# Altium project EchoProject.PrjPcb
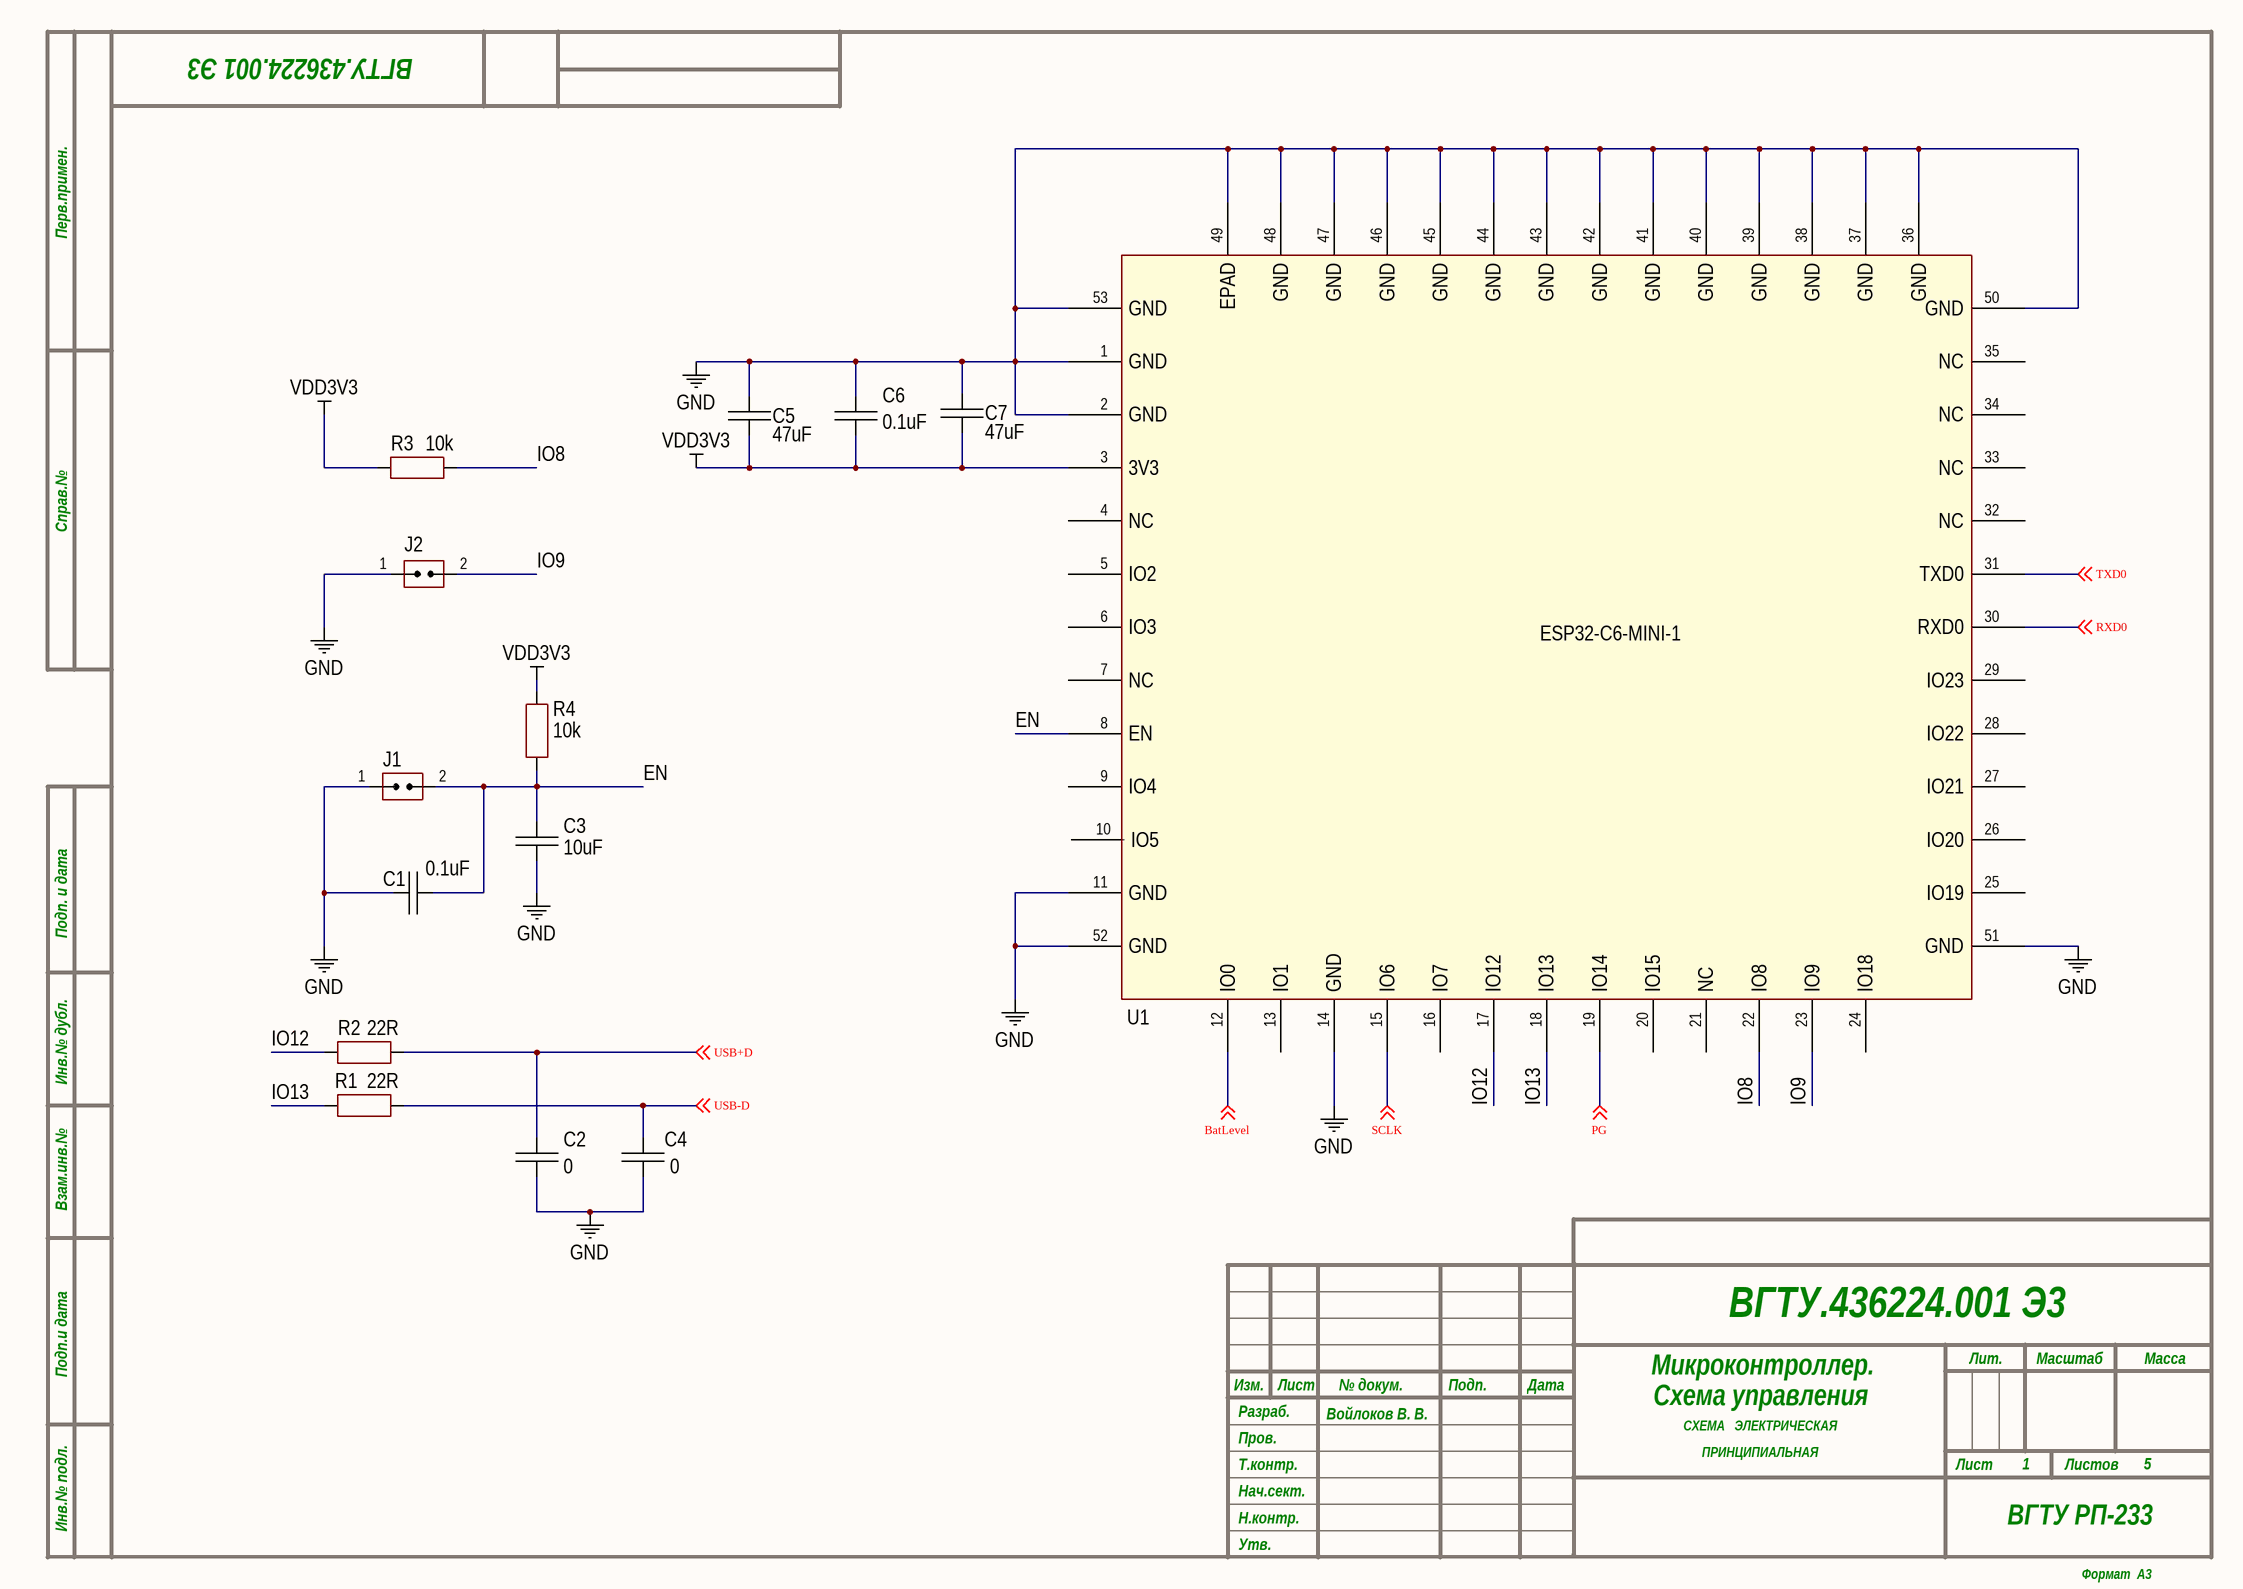
[diagram p0: 01_MCU_ESP32C6.SchDoc]
5 sheets, 71 parts. Net scope: global (net labels, ports and power ports of the same name join across sheets).
Sheets:
  01_MCU_ESP32C6.SchDoc
  02_ULTRASONIC_PGA460.SchDoc
  03_DCDC_BOOST.SchDoc
  04_DCDC_3V3.SchDoc
  05_BATTERY.SchDoc

## Sheet 01_MCU_ESP32C6.SchDoc
size 420 x 297 mm; Author: Войлоков В. В.; CompanyName: ВГТУ РП-233; Organization: ВГТУ; SheetNumber: 1; SheetTotal: 5; DecimalNumber: ВГТУ.436224.001; Name1: Микроконтроллер.; Name2: Схема управления

### Parts
C1  value 0.1uF  [CAP: 0603]
C2  value 0  [CAP: 0603]
C3  value 10uF  [CAP: 0603]
C4  value 0  [CAP: 0603]
C5  value 47uF  [CAP: 0805]
C6  value 0.1uF  [CAP: 0603]
C7  value 47uF  [CAP: 0805]
J1  (no value)  [CON: JUMPER x1]
J2  (no value)  [CON: JUMPER x1]
R1  value 22R  [RES: 0603]
R2  value 22R  [RES: 0603]
R3  value 10k  [RES: 0603]
R4  value 10k  [RES: 0603]
U1  ESP32-C6-MINI-1  [ESP32-C6_EXP]

### Nets
GND: C1.2 C2.2 C3.1 C4.2 C5.2 C6.2 C7.2 J1.1(IN) J2.1(IN) U1.1(GND) U1.2(GND) U1.11(GND) U1.14(GND) U1.36(GND) U1.37(GND) U1.38(GND) U1.39(GND) U1.40(GND) U1.41(GND) U1.42(GND) U1.43(GND) U1.44(GND) U1.45(GND) U1.46(GND) U1.47(GND) U1.48(GND) U1.49(EPAD) U1.50(GND) U1.51(GND) U1.52(GND) U1.53(GND)
VDD3V3: C5.1 C6.1 C7.1 R3.2 R4.2 U1.3(3V3)
BatLevel: U1.12(IO0) ; off-sheet BatLevel
EN: C1.1 C3.2 J1.2(IN) R4.1 U1.8(EN)
IO8: R3.1 U1.22(IO8)
IO9: J2.2(IN) U1.23(IO9)
IO12: R2.2 U1.17(IO12)
IO13: R1.2 U1.18(IO13)
PG: U1.19(IO14) ; off-sheet PG
RXD0: U1.30(RXD0) ; off-sheet RXD0
SCLK: U1.15(IO6) ; off-sheet SCLK
TXD0: U1.31(TXD0) ; off-sheet TXD0
USB+D: C2.1 R2.1 ; off-sheet USB+D
USB-D: C4.1 R1.1 ; off-sheet USB-D

Not connected (* = marked no-connect by the designer): U1 4(NC) 5(IO2) 6(IO3) 7(NC) 9(IO4) 10(IO5) 13(IO1) 16(IO7) 20(IO15) 21(NC) 24(IO18) 25(IO19) 26(IO20) 27(IO21) 28(IO22) 29(IO23) 32(NC) 33(NC) 34(NC) 35(NC)

### Notes on the sheet
- Перв.примен.
- Справ.№
- Подп. и дата
- Инв.№ дубл.
- Взам.инв.№
- Подп.и дата
- Разраб.
- Изм.
- Лист
- № докум.
- Подп.
- Дата
- Лит.
- Масштаб
- Масса
- Т.контр.
- Пров.
- СХЕМА   ЭЛЕКТРИЧЕСКАЯ
- ПРИНЦИПИАЛЬНАЯ
- Листов
- Инв.№ подл.
- Утв.
- Н.контр.
- Нач.сект.
- Формат  A3

### Library data of the parts
C1 C6 = Ceramic_0603: Manufacturer: Yageo; PartNumber: CC0603KRX7R7BB104; ValueManufacturerPartNumber: Ceramic capacitor, 0.1uF, X7R, ±10%, 16V, 0603, -55...+125°C; TypeCapacitor: Ceramic capacitor; Tolerance: ±10%; TypeDielectric: X7R; Voltage: 16V; Package: 0603; HelpURL: https://www.digikey.com/product-detail/en/yageo/CC0603KRX7R7BB104/311-1088-1-ND/302998; Temperature: -55...+125°C
C2 C4 = Ceramic_0603: Manufacturer: Yageo; PartNumber: CC0603KRX7R7BB104; ValueManufacturerPartNumber: Ceramic capacitor, 0, X7R, ±10%, 16V, 0603, -55...+125°C; TypeCapacitor: Ceramic capacitor; Tolerance: ±10%; TypeDielectric: X7R; Voltage: 16V; Package: 0603; HelpURL: https://www.digikey.com/product-detail/en/yageo/CC0603KRX7R7BB104/311-1088-1-ND/302998; Temperature: -55...+125°C
C3 = Ceramic_0603: Manufacturer: Yageo; PartNumber: CC0603KRX7R7BB104; ValueManufacturerPartNumber: Ceramic capacitor, 10uF, X7R, ±10%, 16V, 0603, -55...+125°C; TypeCapacitor: Ceramic capacitor; Tolerance: ±10%; TypeDielectric: X7R; Voltage: 16V; Package: 0603; HelpURL: https://www.digikey.com/product-detail/en/yageo/CC0603KRX7R7BB104/311-1088-1-ND/302998; Temperature: -55...+125°C
C5 C7 = Ceramic_0805: Manufacturer: Yageo; PartNumber: CC0805KRX7R7BB104; ValueManufacturerPartNumber: Ceramic capacitor, 47uF, X7R, ±10%, 16V, 0805, -55...+125°C; TypeCapacitor: Ceramic capacitor; Tolerance: ±10%; TypeDielectric: X7R; Voltage: 16V; Package: 0805; HelpURL: https://www.digikey.com/product-detail/en/yageo/CC0805KRX7R7BB104/311-1142-1-ND/303052; Temperature: -55...+125°C
J1 J2 = Jumper_single: CommentText: "Перемычка"
R1 R2 = Resistor_0603: Manufacturer: Yageo; PartNumber: RC0603JR-07100RL; ValueManufacturerPartNumber: Resistor film, 22R, ±5%, 0603, 0.1W, -55...+125°C; TypeResistor: Resistor film; Power: 0.1W; Tolerance: ±5%; Package: 0603; HelpURL: https://www.digikey.com/product-detail/en/yageo/RC0603JR-07100RL/311-100GRCT-ND/729644; Temperature: -55...+125°C
R3 R4 = Resistor_0603: Manufacturer: Yageo; PartNumber: RC0603JR-07100RL; ValueManufacturerPartNumber: Resistor film, 10k, ±5%, 0603, 0.1W, -55...+125°C; TypeResistor: Resistor film; Power: 0.1W; Tolerance: ±5%; Package: 0603; HelpURL: https://www.digikey.com/product-detail/en/yageo/RC0603JR-07100RL/311-100GRCT-ND/729644; Temperature: -55...+125°C

## Sheet 02_ULTRASONIC_PGA460.SchDoc
size 420 x 297 mm; Author: Войлоков В. В.; CompanyName: ВГТУ РП-233; SheetNumber: 2; SheetTotal: 5; DecimalNumber: ВГТУ.436224.001; Name1: Приемопередатчик; Name2: ультразвуковой
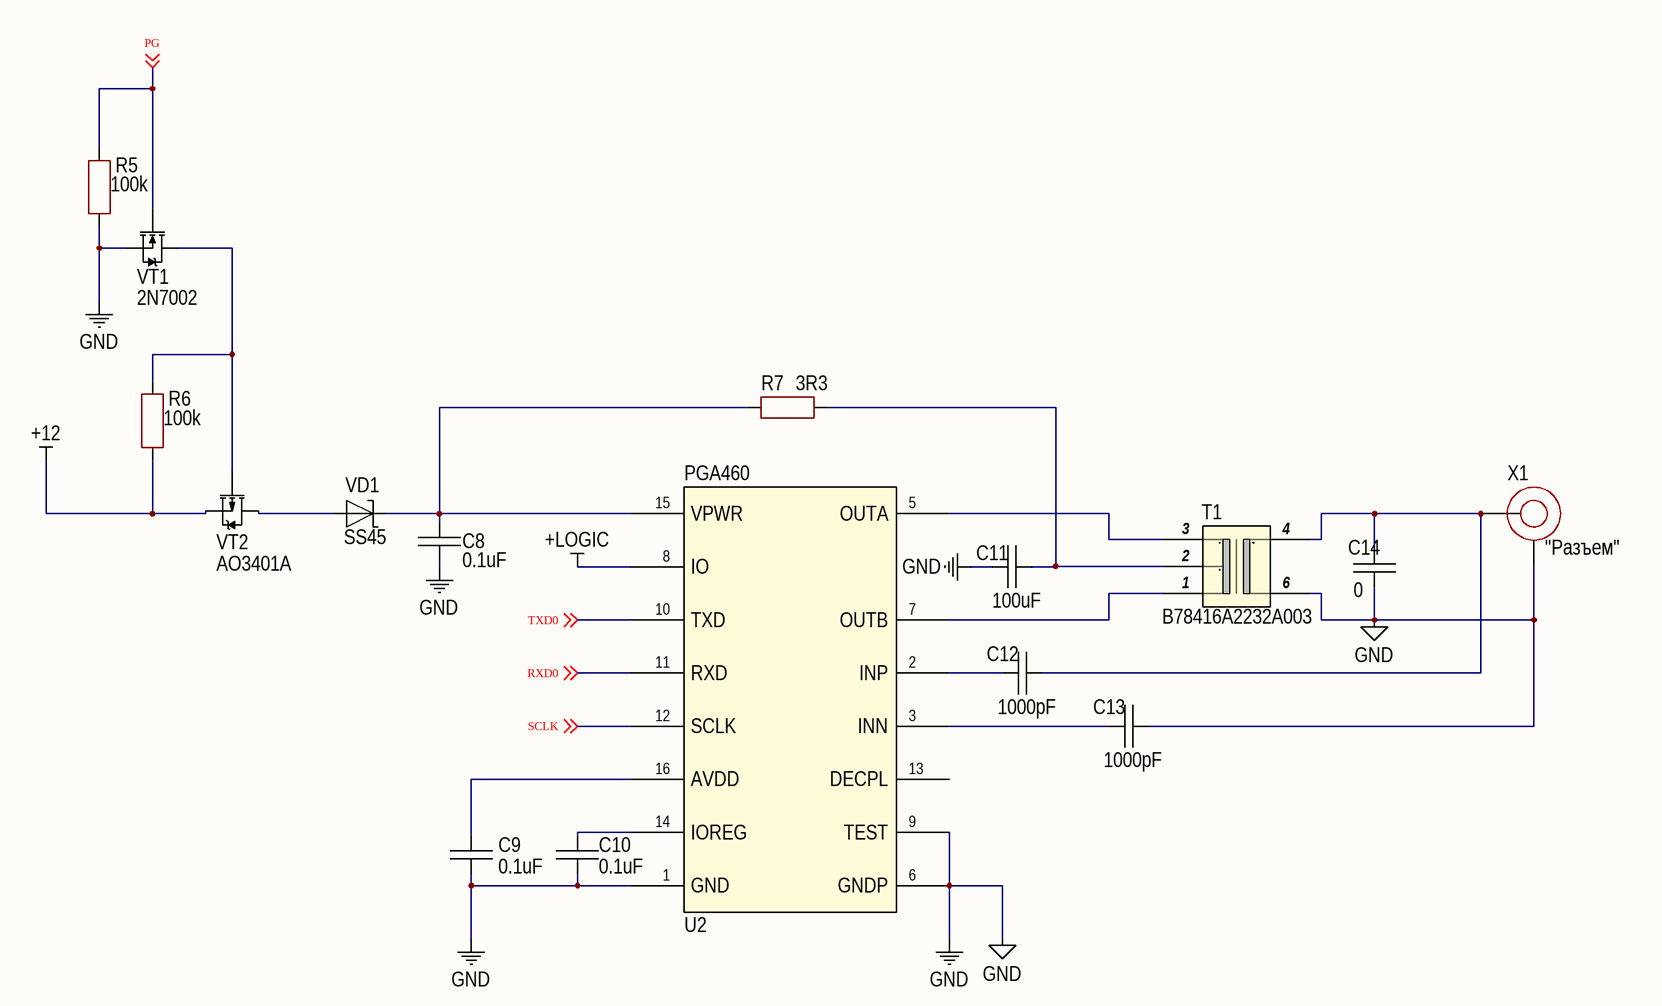
[diagram p1: 02_ULTRASONIC_PGA460.SchDoc]

### Parts
C8  value 0.1uF  [CAP: 0603]
C9  value 0.1uF  [CAP: 0603]
C10  value 0.1uF  [CAP: 0603]
C11  value 100uF  [CAP: 1206]
C12  value 1000pF  [CAP: 0805]
C13  value 1000pF  [CAP: 0805]
C14  value 0  [CAP: 0805]
R5  value 100k  [RES: 0603]
R6  value 100k  [RES: 0603]
R7  value 3R3  [RES: 2010]
T1  B78416A2232A003  [B78416_TDK]
U2  PGA460  [16-TSSOP]
VD1  PartNumber: SS45  [DIODE: SMC]
VT1  PartNumber: 2N7002  [SOT23]
VT2  PartNumber: AO3401A  [SOT23]
X1  CommentText: "Разъем"  [CON: SMA]

### Nets
+12: R6.1 VT2.2(S)
+LOGIC: U2.8(IO)
GND: C8.1 C9.1 C10.1 C11.2 C13.1 C14.2 R5.1 T1.6 U2.1(GND) U2.6(GNDP) U2.9(TEST) VT1.2(S) X1.2
PG: R5.2 VT1.1(G) ; off-sheet PG
RXD0: U2.11(RXD) ; off-sheet RXD0
SCLK: U2.12(SCLK) ; off-sheet SCLK
TXD0: U2.10(TXD) ; off-sheet TXD0
NetC8_2: C8.2 R7.1 U2.15(VPWR) VD1.2
NetC9_2: C9.2 U2.16(AVDD)
NetC10_2: C10.2 U2.14(IOREG)
NetC11_1: C11.1 R7.2 T1.2
NetC12_1: C12.1 C14.1 T1.4 X1.1
NetC12_2: C12.2 U2.2(INP)
NetC13_2: C13.2 U2.3(INN)
NetR6_2: R6.2 VT1.3(D) VT2.1(G)
NetT1_1: T1.1 U2.7(OUTB)
NetT1_3: T1.3 U2.5(OUTA)
NetVD1_1: VD1.1 VT2.3(D)

Not connected (* = marked no-connect by the designer): U2 13(DECPL)

### Notes on the sheet
- Перв.примен.
- Справ.№
- Подп. и дата
- Инв.№ дубл.
- Взам.инв.№
- Подп.и дата
- Разраб.
- Изм.
- Лист
- № докум.
- Подп.
- Дата
- Лит.
- Масштаб
- Масса
- Т.контр.
- Пров.
- СХЕМА   ЭЛЕКТРИЧЕСКАЯ
- ПРИНЦИПИАЛЬНАЯ
- Листов
- Инв.№ подл.
- Утв.
- Н.контр.
- Нач.сект.
- Формат  A3

### Library data of the parts
C8-C10 = Ceramic_0603: as C1 on sheet 01_MCU_ESP32C6; Package: 0603; HelpURL: https://www.digikey.com/product-detail/en/yageo/CC0603KRX7R7BB104/311-1088-1-ND/302998; Temperature: -55...+125°C
C11 = Ceramic_1206: Manufacturer: Yageo; PartNumber: CC1206KRX7R9BB104; ValueManufacturerPartNumber: Ceramic capacitor, 100uF, X7R, ±10%, 50V, 1206, -55...+125°C; TypeCapacitor: Ceramic capacitor; Tolerance: ±10%; TypeDielectric: X7R; Voltage: 50V; Package: 1206; HelpURL: https://www.digikey.com/product-detail/en/yageo/CC1206KRX7R9BB104/311-1179-1-ND/303089; Temperature: -55...+125°C
C12 C13 = Ceramic_0805: Manufacturer: Yageo; PartNumber: CC0805KRX7R7BB104; ValueManufacturerPartNumber: Ceramic capacitor, 1000pF, NP0, ±5%, 500V, 0805, -55...+125°C; TypeCapacitor: Ceramic capacitor; Tolerance: ±5%; TypeDielectric: NP0; Voltage: 500V; Package: 0805; HelpURL: https://www.digikey.com/product-detail/en/yageo/CC0805KRX7R7BB104/311-1142-1-ND/303052; Temperature: -55...+125°C
C14 = Ceramic_0805: Manufacturer: Yageo; PartNumber: CC0805KRX7R7BB104; ValueManufacturerPartNumber: Ceramic capacitor, 0, NP0, ±5%, 16V, 0805, -55...+125°C; TypeCapacitor: Ceramic capacitor; Tolerance: ±5%; TypeDielectric: NP0; Voltage: 16V; Package: 0805; HelpURL: https://www.digikey.com/product-detail/en/yageo/CC0805KRX7R7BB104/311-1142-1-ND/303052; Temperature: -55...+125°C
R5 R6 = Resistor_0603: Manufacturer: Yageo; PartNumber: RC0603JR-07100RL; ValueManufacturerPartNumber: Resistor film, 100k, ±5%, 0603, 0.1W, -55...+125°C; TypeResistor: Resistor film; Power: 0.1W; Tolerance: ±5%; Package: 0603; HelpURL: https://www.digikey.com/product-detail/en/yageo/RC0603JR-07100RL/311-100GRCT-ND/729644; Temperature: -55...+125°C
R7 = Resistor_2010: Manufacturer: Yageo; PartNumber: RC2010JK-07100RL; ValueManufacturerPartNumber: Resistor film, 3R3, ±5%, 2010, 0.75W, -55...+125°C; TypeResistor: Resistor film; Power: 0.75W; Tolerance: ±5%; Package: 2010; HelpURL: https://www.digikey.com/product-detail/en/yageo/RC2010JK-07100RL/YAG3381CT-ND/5962203; Temperature: -55...+125°C
T1 = B78416A2232A003: Description; Manufacturer_Name: TDK; Copyright: Copyright (C) 2025 Ultra Librarian. All rights reserved.; Manufacturer_Part_Number: B78416A2232A003; RefDes: RefDes; Type: Type
U2 = PGA460: pin to pad: 1>1+4
VD1 = Schottky_single: Manufacturer: Diodes Incorporated; ValueManufacturerPartNumber: Schottky diode, 80V, 500mA, 1V, 15pF, SOD-123, -55...+150°C; TypeDiode: Schottky diode; Voltage: 80V; Current: 500mA; VoltageDrop: 1V; RecoveryTime: 15pF; Package: SOD-123; HelpURL: https://www.digikey.com/product-detail/en/diodes-incorporated/MBR0580S1-7/MBR0580S1-7DICT-ND/5080371; Temperature: -55...+150°C
VT1 = MOSFET_N_132: Manufacturer: Infineon Technologies; ValueManufacturerPartNumber: MOSFET N-channel transistor, 80V, 7A, 9.1nC, 2.5W, 34mOhm, 756pF, 8-TDSON, -55...+150°C; TypeTransistor: MOSFET N-channel transistor; VoltageDS: 80V; CurrentDS: 7A; RDS: 34mOhm; GateCharge: 9.1nC; InputCapacitor: 756pF; MaxPower: 2.5W; Package: 8-TDSON; HelpURL: https://www.digikey.com/product-detail/en/infineon-technologies/BSC340N08NS3GATMA1/BSC340N08NS3GATMA1TR-ND/2080655; Temperature: -55...+150°C
VT2 = MOSFET_P_132: Manufacturer: Infineon Technologies; ValueManufacturerPartNumber: MOSFET P-channel transistor, 20V, 2.6A, 2.9nC, 2.5W, 135mOhm, 220pF, SOT-23, -55...+150°C; TypeTransistor: MOSFET P-channel transistor; VoltageDS: 20V; CurrentDS: 2.6A; RDS: 135mOhm; GateCharge: 2.9nC; InputCapacitor: 220pF; MaxPower: 2.5W; Package: SOT-23; HelpURL: https://www.digikey.com/product-detail/en/infineon-technologies/IRLML2246TRPBF/IRLML2246TRPBFCT-ND/2639576; Temperature: -55...+150°C
X1 = Connector_SMA: Manufacturer: TE Connectivity; ValueManufacturerPartNumber: Connector SMA, 50 Ohm, 3GHz; PartNumber: 5-1814832-1; TypeConnector: Connector SMA; Frequency: 3GHz; Impedance: 50 Ohm; HelpURL: https://www.digikey.com/product-detail/en/te-connectivity-amp-connectors/5-1814832-1/A97594-ND/1755982

## Sheet 03_DCDC_BOOST.SchDoc
size 209 x 297 mm; Author: Войлоков В. М.; CompanyName: ВГТУ РП-233; SheetNumber: 3; SheetTotal: 5; DecimalNumber: ВГТУ.436224.001; Name1: Преобразователь; Name2: напряжения к 12В
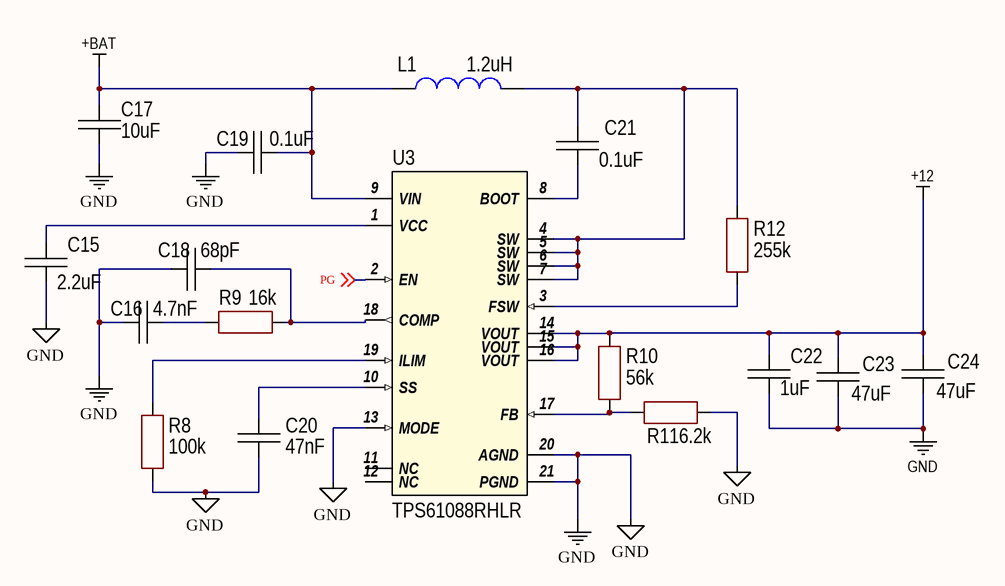
[diagram p2: 03_DCDC_BOOST.SchDoc]

### Parts
C15  value 2.2uF  [CAP: 0805]
C16  value 4.7nF  [CAP: 0805]
C17  value 10uF  [CAP: 1206]
C18  value 68pF  [CAP: 0805]
C19  value 0.1uF  [CAP: 0603]
C20  value 47nF  [CAP: 0603]
C21  value 0.1uF  [CAP: 1210]
C22  value 1uF  [CAP: 0805]
C23  value 47uF  [CAP: 1206]
C24  value 47uF  [CAP: 1206]
L1  value 1.2uH  [IND: SRP1265A]
R8  value 100k  [RES: 0603]
R9  value 16k  [RES: 0603]
R10  value 56k  [RES: 0603]
R11  value 6.2k  [RES: 0603]
R12  value 255k  [RES: 0603]
U3  TPS61088RHLR  [RHL0020A]

### Nets
+12: C22.2 C23.2 C24.2 R10.2 U3.14(VOUT) U3.15(VOUT) U3.16(VOUT)
+BAT: C17.1 C19.1 L1.2 U3.9(VIN)
GND: C15.1 C16.2 C17.2 C18.2 C19.2 C20.1 C22.1 C23.1 C24.1 R8.1 R11.2 U3.13(MODE) U3.20(AGND) U3.21(PGND)
PG: U3.2(EN) ; off-sheet PG
NetC15_2: C15.2 U3.1(VCC)
NetC16_1: C16.1 R9.1
NetC18_1: C18.1 R9.2 U3.18(COMP)
NetC20_2: C20.2 U3.10(SS)
NetC21_1: C21.1 U3.8(BOOT)
NetC21_2: C21.2 L1.1 R12.2 U3.4(SW) U3.5(SW) U3.6(SW) U3.7(SW)
NetR8_2: R8.2 U3.19(ILIM)
NetR10_1: R10.1 R11.1 U3.17(FB)
NetR12_1: R12.1 U3.3(FSW)

Not connected (* = marked no-connect by the designer): U3 11(NC) 12(NC)

### Notes on the sheet
- Перв.примен.
- Справ.№
- Подп. и дата
- Инв.№ дубл.
- Взам.инв.№
- Подп.и дата
- Разраб.
- Изм.
- Лист
- № докум.
- Подп.
- Дата
- Лит.
- Масштаб
- Масса
- Т.контр.
- Пров.
- СХЕМА   ЭЛЕКТРИЧЕСКАЯ
- ПРИНЦИПИАЛЬНАЯ
- Листов
- Инв.№ подл.
- Утв.
- Н.контр.
- Нач.сект.

### Library data of the parts
C15 = Ceramic_0805: Manufacturer: Yageo; PartNumber: CC0805KRX7R7BB104; ValueManufacturerPartNumber: Ceramic capacitor, 2.2uF, X7R, ±10%, 16V, 0805, -55...+125°C; TypeCapacitor: Ceramic capacitor; Tolerance: ±10%; TypeDielectric: X7R; Voltage: 16V; Package: 0805; HelpURL: https://www.digikey.com/product-detail/en/yageo/CC0805KRX7R7BB104/311-1142-1-ND/303052; Temperature: -55...+125°C
C16 = Ceramic_0805: Manufacturer: Yageo; PartNumber: CC0805KRX7R7BB104; ValueManufacturerPartNumber: Ceramic capacitor, 4.7nF, X7R, ±10%, 16V, 0805, -55...+125°C; TypeCapacitor: Ceramic capacitor; Tolerance: ±10%; TypeDielectric: X7R; Voltage: 16V; Package: 0805; HelpURL: https://www.digikey.com/product-detail/en/yageo/CC0805KRX7R7BB104/311-1142-1-ND/303052; Temperature: -55...+125°C
C17 = Ceramic_1206: Manufacturer: Yageo; PartNumber: CC1206KRX7R9BB104; ValueManufacturerPartNumber: Ceramic capacitor, 10uF, X7R, ±10%, 50V, 1206, -55...+125°C; TypeCapacitor: Ceramic capacitor; Tolerance: ±10%; TypeDielectric: X7R; Voltage: 50V; Package: 1206; HelpURL: https://www.digikey.com/product-detail/en/yageo/CC1206KRX7R9BB104/311-1179-1-ND/303089; Temperature: -55...+125°C
C18 = Ceramic_0805: Manufacturer: Yageo; PartNumber: CC0805KRX7R7BB104; ValueManufacturerPartNumber: Ceramic capacitor, 68pF, X7R, ±10%, 16V, 0805, -55...+125°C; TypeCapacitor: Ceramic capacitor; Tolerance: ±10%; TypeDielectric: X7R; Voltage: 16V; Package: 0805; HelpURL: https://www.digikey.com/product-detail/en/yageo/CC0805KRX7R7BB104/311-1142-1-ND/303052; Temperature: -55...+125°C
C19 = Ceramic_0603: as C1 on sheet 01_MCU_ESP32C6; Package: 0603; HelpURL: https://www.digikey.com/product-detail/en/yageo/CC0603KRX7R7BB104/311-1088-1-ND/302998; Temperature: -55...+125°C
C20 = Ceramic_0603: Manufacturer: Yageo; PartNumber: CC0603KRX7R7BB104; ValueManufacturerPartNumber: Ceramic capacitor, 47nF, X7R, ±10%, 16V, 0603, -55...+125°C; TypeCapacitor: Ceramic capacitor; Tolerance: ±10%; TypeDielectric: X7R; Voltage: 16V; Package: 0603; HelpURL: https://www.digikey.com/product-detail/en/yageo/CC0603KRX7R7BB104/311-1088-1-ND/302998; Temperature: -55...+125°C
C21 = Ceramic_1210: Manufacturer: Yageo; PartNumber: CC1210KKX7R9BB104; ValueManufacturerPartNumber: Ceramic capacitor, 0.1uF, X7R, ±10%, 50V, 1210, -55...+125°C; TypeCapacitor: Ceramic capacitor; Tolerance: ±10%; TypeDielectric: X7R; Voltage: 50V; Package: 1210; HelpURL: https://www.digikey.com/product-detail/en/yageo/CC1210KKX7R9BB104/311-4522-1-ND/8025611; Temperature: -55...+125°C
C22 = Ceramic_0805: Manufacturer: Yageo; PartNumber: CC0805KRX7R7BB104; ValueManufacturerPartNumber: Ceramic capacitor, 1uF, X7R, ±10%, 16V, 0805, -55...+125°C; TypeCapacitor: Ceramic capacitor; Tolerance: ±10%; TypeDielectric: X7R; Voltage: 16V; Package: 0805; HelpURL: https://www.digikey.com/product-detail/en/yageo/CC0805KRX7R7BB104/311-1142-1-ND/303052; Temperature: -55...+125°C
C23 C24 = Ceramic_1206: Manufacturer: Yageo; PartNumber: CC1206KRX7R9BB104; ValueManufacturerPartNumber: Ceramic capacitor, 47uF, X7R, ±10%, 50V, 1206, -55...+125°C; TypeCapacitor: Ceramic capacitor; Tolerance: ±10%; TypeDielectric: X7R; Voltage: 50V; Package: 1206; HelpURL: https://www.digikey.com/product-detail/en/yageo/CC1206KRX7R9BB104/311-1179-1-ND/303089; Temperature: -55...+125°C
L1 = Inductor_SRP1265A: Manufacturer: Bourns; PartNumber: SRP1265A-4R7M; ValueManufacturerPartNumber: Fixed inductor, 1.2uH, ±20%, SRP1265A, 13.5A, -40...+150°C; TypeInductor: Fixed inductor; MaxCurrent: 13.5A; Tolerance: ±20%; Package: SRP1265A; HelpURL: https://www.digikey.com/product-detail/en/bourns-inc/SRP1265A-4R7M/SRP1265A-4R7MCT-ND/4876721; Temperature: -40...+150°C
R8 = Resistor_0603: as R5 on sheet 02_ULTRASONIC_PGA460; Package: 0603; HelpURL: https://www.digikey.com/product-detail/en/yageo/RC0603JR-07100RL/311-100GRCT-ND/729644; Temperature: -55...+125°C
R9 = Resistor_0603: Manufacturer: Yageo; PartNumber: RC0603JR-07100RL; ValueManufacturerPartNumber: Resistor film, 16k, ±5%, 0603, 0.1W, -55...+125°C; TypeResistor: Resistor film; Power: 0.1W; Tolerance: ±5%; Package: 0603; HelpURL: https://www.digikey.com/product-detail/en/yageo/RC0603JR-07100RL/311-100GRCT-ND/729644; Temperature: -55...+125°C
R10 = Resistor_0603: Manufacturer: Yageo; PartNumber: RC0603JR-07100RL; ValueManufacturerPartNumber: Resistor film, 56k, ±5%, 0603, 0.1W, -55...+125°C; TypeResistor: Resistor film; Power: 0.1W; Tolerance: ±5%; Package: 0603; HelpURL: https://www.digikey.com/product-detail/en/yageo/RC0603JR-07100RL/311-100GRCT-ND/729644; Temperature: -55...+125°C
R11 = Resistor_0603: Manufacturer: Yageo; PartNumber: RC0603JR-07100RL; ValueManufacturerPartNumber: Resistor film, 6.2k, ±5%, 0603, 0.1W, -55...+125°C; TypeResistor: Resistor film; Power: 0.1W; Tolerance: ±5%; Package: 0603; HelpURL: https://www.digikey.com/product-detail/en/yageo/RC0603JR-07100RL/311-100GRCT-ND/729644; Temperature: -55...+125°C
R12 = Resistor_0603: Manufacturer: Yageo; PartNumber: RC0603JR-07100RL; ValueManufacturerPartNumber: Resistor film, 255k, ±5%, 0603, 0.1W, -55...+125°C; TypeResistor: Resistor film; Power: 0.1W; Tolerance: ±5%; Package: 0603; HelpURL: https://www.digikey.com/product-detail/en/yageo/RC0603JR-07100RL/311-100GRCT-ND/729644; Temperature: -55...+125°C
U3 = TPS61088RHLR: 10-A Fully-Integrated Synchronous Boost Converter 20-VQFN -40 to 125; Manufacturer_Name: Texas Instruments; Alternate_PartNumber: TPS61088RHLT; CompType: IC; TYPE: TYPE; RefDes: RefDes; Copyright: Copyright (C) 2026 Ultra Librarian. All rights reserved.; Manufacturer_Part_Number: TPS61088RHLR; Application_BuildNumber: *; PartNumber: TPS61088RHLR; PackageReference: RHL0020A; MountType: SMT; RoHS: Y; Manufacturer: Texas Instruments

## Sheet 04_DCDC_3V3.SchDoc
size 209 x 297 mm; Author: Войлоков В. М.; CompanyName: ВГТУ РП-233; SheetNumber: 4; SheetTotal: 5; DecimalNumber: 123; Name1: Преобразователь; Name2: напряжения к 3.3В
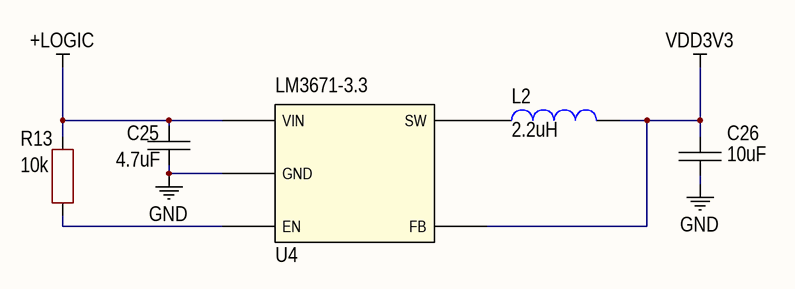
[diagram p3: 04_DCDC_3V3.SchDoc]

### Parts
C25  value 4.7uF  [CAP: 0805]
C26  value 10uF  [CAP: 0805]
L2  value 2.2uH  [IND: SDR0805]
R13  value 10k  [RES: 0603]
U4  LM3671-3.3  [SOT23-5]

### Nets
+LOGIC: C25.2 R13.2 U4.1(VIN)
GND: C25.1 C26.1 U4.2(GND)
VDD3V3: C26.2 L2.1 U4.4(FB)
NetL2_2: L2.2 U4.5(SW)
NetR13_1: R13.1 U4.3(EN)

### Notes on the sheet
- Перв.примен.
- Справ.№
- Подп. и дата
- Инв.№ дубл.
- Взам.инв.№
- Подп.и дата
- Разраб.
- Изм.
- Лист
- № докум.
- Подп.
- Дата
- Лит.
- Масштаб
- Масса
- Т.контр.
- Пров.
- СХЕМА   ЭЛЕКТРИЧЕСКАЯ
- ПРИНЦИПИАЛЬНАЯ
- Листов
- Инв.№ подл.
- Утв.
- Н.контр.
- Нач.сект.

### Library data of the parts
C25 = Ceramic_0805: Manufacturer: Yageo; PartNumber: CC0805KRX7R7BB104; ValueManufacturerPartNumber: Ceramic capacitor, 4.7uF, X7R, ±10%, 16V, 0805, -55...+125°C; TypeCapacitor: Ceramic capacitor; Tolerance: ±10%; TypeDielectric: X7R; Voltage: 16V; Package: 0805; HelpURL: https://www.digikey.com/product-detail/en/yageo/CC0805KRX7R7BB104/311-1142-1-ND/303052; Temperature: -55...+125°C
C26 = Ceramic_0805: Manufacturer: Yageo; PartNumber: CC0805KRX7R7BB104; ValueManufacturerPartNumber: Ceramic capacitor, 10uF, X7R, ±10%, 16V, 0805, -55...+125°C; TypeCapacitor: Ceramic capacitor; Tolerance: ±10%; TypeDielectric: X7R; Voltage: 16V; Package: 0805; HelpURL: https://www.digikey.com/product-detail/en/yageo/CC0805KRX7R7BB104/311-1142-1-ND/303052; Temperature: -55...+125°C
L2 = Inductor_SDR0805: Manufacturer: Bourns; PartNumber: SDR0805-4R7ML; ValueManufacturerPartNumber: Fixed inductor, 2.2uH, ±20%, SDR0805, 3.7A, -40...+125°C; TypeInductor: Fixed inductor; MaxCurrent: 3.7A; Tolerance: ±20%; Package: SDR0805; HelpURL: https://www.digikey.com/product-detail/en/bourns-inc/SDR0805-4R7ML/SDR0805-4R7MLCT-ND/2352947; Temperature: -40...+125°C
R13 = Resistor_0603: as R3 on sheet 01_MCU_ESP32C6; Package: 0603; HelpURL: https://www.digikey.com/product-detail/en/yageo/RC0603JR-07100RL/311-100GRCT-ND/729644; Temperature: -55...+125°C
U4 = LM3671-3.3: Manufacturer: Texas Instruments; Vin: 2.7V - 5.5V; Vout: 3.3V; Iout: 600 mA

## Sheet 05_BATTERY.SchDoc
size 420 x 297 mm; Author: Войлоков В. М.; CompanyName: ВГТУ РП-233; SheetNumber: 5; SheetTotal: 5; DecimalNumber: ВГТУ.436224.001; Name1: Контроллер; Name2: заряда
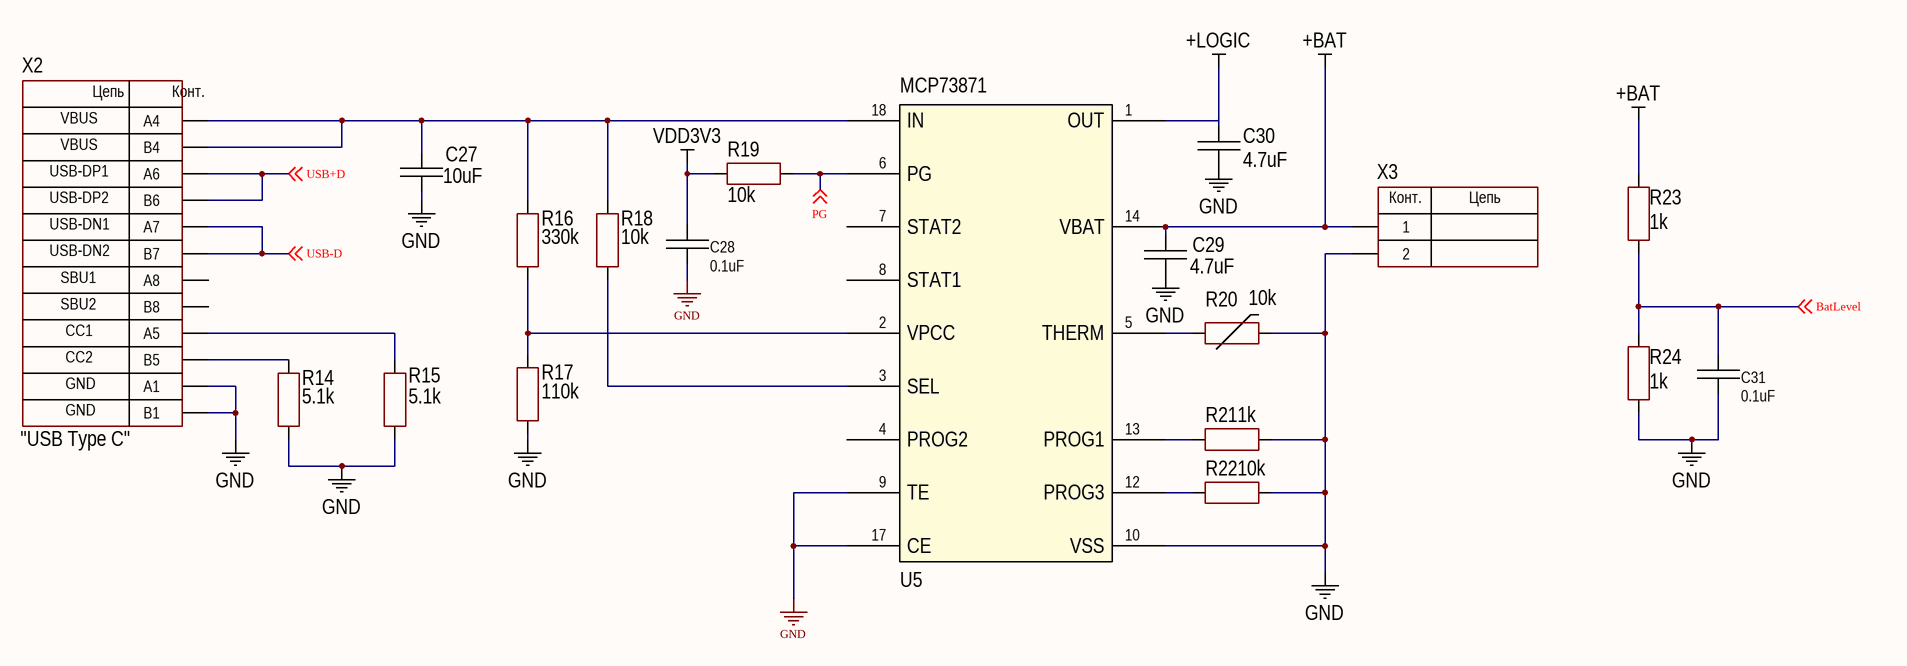
[diagram p4: 05_BATTERY.SchDoc]

### Parts
C27  value 10uF  [CAP: 0805]
C28  value 0.1uF  [CAP: 0603]
C29  value 4.7uF  [CAP: 0805]
C30  value 4.7uF  [CAP: 0805]
C31  value 0.1uF  [CAP: 0603]
R14  value 5.1k  [RES: 0603]
R15  value 5.1k  [RES: 0603]
R16  value 330k  [RES: 0603]
R17  value 110k  [RES: 0603]
R18  value 10k  [RES: 0603]
R19  value 10k  [RES: 0603]
R20  value 10k  [RES: B57237 (NTC)]
R21  value 1k  [RES: 0603]
R22  value 10k  [RES: 0603]
R23  value 1k  [RES: 0603]
R24  value 1k  [RES: 0603]
U5  MCP73871  [20-QFN (4x4)]
X2  CommentText: "USB Type C"  [CON: TYPE-C-31-M-12]
X3  (no value)  [CON: CWF-2R]

### Nets
+BAT: C29.2 R23.1 U5.14(VBAT) X3.1
+LOGIC: C30.2 U5.1(OUT)
GND: C27.1 C28.1 C29.1 C30.1 C31.1 R14.2 R15.2 R17.1 R20.2 R21.2 R22.2 R24.2 U5.9(TE) U5.10(VSS) U5.17(CE) X2.A1 X2.B1 X3.2
VDD3V3: C28.2 R19.2
BatLevel: C31.2 R23.2 R24.1 ; off-sheet BatLevel
PG: R19.1 U5.6(PG) ; off-sheet PG
USB+D: X2.A6 X2.B6 ; off-sheet USB+D
USB-D: X2.A7 X2.B7 ; off-sheet USB-D
NetC27_2: C27.2 R16.2 R18.2 U5.18(IN) X2.A4 X2.B4
NetR14_1: R14.1 X2.B5
NetR15_1: R15.1 X2.A5
NetR16_1: R16.1 R17.2 U5.2(VPCC)
NetR18_1: R18.1 U5.3(SEL)
NetR20_1: R20.1 U5.5(THERM)
NetR21_1: R21.1 U5.13(PROG1)
NetR22_1: R22.1 U5.12(PROG3)

Not connected (* = marked no-connect by the designer): U5 4(PROG2) 7(STAT2) 8(STAT1); X2 A8 B8

### Notes on the sheet
- Перв.примен.
- Справ.№
- Подп. и дата
- Инв.№ дубл.
- Взам.инв.№
- Подп.и дата
- Разраб.
- Изм.
- Лист
- № докум.
- Подп.
- Дата
- Лит.
- Масштаб
- Масса
- Т.контр.
- Пров.
- СХЕМА   ЭЛЕКТРИЧЕСКАЯ
- ПРИНЦИПИАЛЬНАЯ
- Листов
- Инв.№ подл.
- Утв.
- Н.контр.
- Нач.сект.
- Формат  A3
- (in symbol Connector_USB_Type_C) Цепь; Конт.; VBUS; USB-DP1; USB-DP2; USB-DN1; USB-DN2; SBU1; SBU2; CC1; CC2; GND
- (in symbol CWF-2) Конт.; Цепь

### Library data of the parts
C27 = Ceramic_0805: as C26 on sheet 04_DCDC_3V3; Package: 0805; HelpURL: https://www.digikey.com/product-detail/en/yageo/CC0805KRX7R7BB104/311-1142-1-ND/303052; Temperature: -55...+125°C
C28 C31 = Ceramic_0603: as C1 on sheet 01_MCU_ESP32C6; Package: 0603; HelpURL: https://www.digikey.com/product-detail/en/yageo/CC0603KRX7R7BB104/311-1088-1-ND/302998; Temperature: -55...+125°C
C29 C30 = Ceramic_0805: as C25 on sheet 04_DCDC_3V3; Package: 0805; HelpURL: https://www.digikey.com/product-detail/en/yageo/CC0805KRX7R7BB104/311-1142-1-ND/303052; Temperature: -55...+125°C
R14 R15 = Resistor_0603: Manufacturer: Yageo; PartNumber: RC0603JR-07100RL; ValueManufacturerPartNumber: Resistor film, 5.1k, ±1%, 0603, 0.1W, -55...+125°C; TypeResistor: Resistor film; Power: 0.1W; Tolerance: ±1%; Package: 0603; HelpURL: https://www.digikey.com/product-detail/en/yageo/RC0603JR-07100RL/311-100GRCT-ND/729644; Temperature: -55...+125°C
R16 = Resistor_0603: Manufacturer: Yageo; PartNumber: RC0603JR-07100RL; ValueManufacturerPartNumber: Resistor film, 330k, ±1%, 0603, 0.1W, -55...+125°C; TypeResistor: Resistor film; Power: 0.1W; Tolerance: ±1%; Package: 0603; HelpURL: https://www.digikey.com/product-detail/en/yageo/RC0603JR-07100RL/311-100GRCT-ND/729644; Temperature: -55...+125°C
R17 = Resistor_0603: Manufacturer: Yageo; PartNumber: RC0603JR-07100RL; ValueManufacturerPartNumber: Resistor film, 110k, ±1%, 0603, 0.1W, -55...+125°C; TypeResistor: Resistor film; Power: 0.1W; Tolerance: ±1%; Package: 0603; HelpURL: https://www.digikey.com/product-detail/en/yageo/RC0603JR-07100RL/311-100GRCT-ND/729644; Temperature: -55...+125°C
R18 R19 R22 = Resistor_0603: Manufacturer: Yageo; PartNumber: RC0603JR-07100RL; ValueManufacturerPartNumber: Resistor film, 10k, ±1%, 0603, 0.1W, -55...+125°C; TypeResistor: Resistor film; Power: 0.1W; Tolerance: ±1%; Package: 0603; HelpURL: https://www.digikey.com/product-detail/en/yageo/RC0603JR-07100RL/311-100GRCT-ND/729644; Temperature: -55...+125°C
R20 = NTC: Manufacturer: Epcos; PartNumber: B57237S229M54; ValueManufacturerPartNumber: NTC resistor, 10k, ±5%, pitch 7.5mm, 7A, -55...+125°C; TypeResistor: NTC resistor; MaxCurrent: 7A; Tolerance: ±5%; Package: pitch 7.5mm; HelpURL: https://www.digikey.com/product-detail/en/epcos-tdk/B57237S229M54/495-76635-1-ND/8126375; Temperature: -55...+125°C
R21 R23 R24 = Resistor_0603: Manufacturer: Yageo; PartNumber: RC0603JR-07100RL; ValueManufacturerPartNumber: Resistor film, 1k, ±1%, 0603, 0.1W, -55...+125°C; TypeResistor: Resistor film; Power: 0.1W; Tolerance: ±1%; Package: 0603; HelpURL: https://www.digikey.com/product-detail/en/yageo/RC0603JR-07100RL/311-100GRCT-ND/729644; Temperature: -55...+125°C
U5 = BQ24074RGTT: pin to pad: 1>1+20 10>10+11 14>14+15+16 18>18+19
X2 = Connector_USB_Type_C: Manufacturer: Korean Hroparts; ValueManufacturerPartNumber: USB Type C, 3A; PartNumber: TYPE-C-31-M-12; TypeConnector: USB Type C; CurrentMax: 3A; HelpURL: https://lcsc.com/product-detail/USB-Type-C_Korean-Hroparts-Elec-TYPE-C-31-M-12_C165948.html
X3 = CWF-2: Manufacturer: Connfly; ValueManufacturerPartNumber: Connector, 2pin, 2.54mm, 250VAC, 3A; PartNumber: CWF-2R; TypeConnector: Connector; VoltageMax: 250VAC; Pitch: 2.54mm; CurrentMax: 3A; Multichannel: 2pin; CommentText: "Разъем"; HelpURL: https://www.chipdip.ru/product/cwf-2r-ds1069-2-mr

## Nets that join several sheets
+12: 02_ULTRASONIC_PGA460 (R6.1 VT2.2), 03_DCDC_BOOST (7 pins)
+BAT: 03_DCDC_BOOST (C17.1 C19.1 L1.2 U3.9), 05_BATTERY (C29.2 R23.1 U5.14 X3.1)
+LOGIC: 02_ULTRASONIC_PGA460 (U2.8), 04_DCDC_3V3 (C25.2 R13.2 U4.1), 05_BATTERY (C30.2 U5.1)
GND: 01_MCU_ESP32C6 (31 pins), 02_ULTRASONIC_PGA460 (13 pins), 03_DCDC_BOOST (14 pins), 04_DCDC_3V3 (C25.1 C26.1 U4.2), 05_BATTERY (18 pins)
VDD3V3: 01_MCU_ESP32C6 (6 pins), 04_DCDC_3V3 (C26.2 L2.1 U4.4), 05_BATTERY (C28.2 R19.2)
BatLevel: 01_MCU_ESP32C6 (U1.12), 05_BATTERY (C31.2 R23.2 R24.1)
PG: 01_MCU_ESP32C6 (U1.19), 02_ULTRASONIC_PGA460 (R5.2 VT1.1), 03_DCDC_BOOST (U3.2), 05_BATTERY (R19.1 U5.6)
RXD0: 01_MCU_ESP32C6 (U1.30), 02_ULTRASONIC_PGA460 (U2.11)
SCLK: 01_MCU_ESP32C6 (U1.15), 02_ULTRASONIC_PGA460 (U2.12)
TXD0: 01_MCU_ESP32C6 (U1.31), 02_ULTRASONIC_PGA460 (U2.10)
USB+D: 01_MCU_ESP32C6 (C2.1 R2.1), 05_BATTERY (X2.A6 X2.B6)
USB-D: 01_MCU_ESP32C6 (C4.1 R1.1), 05_BATTERY (X2.A7 X2.B7)